# Altium project PCB_Soldering_Station.PrjPcb
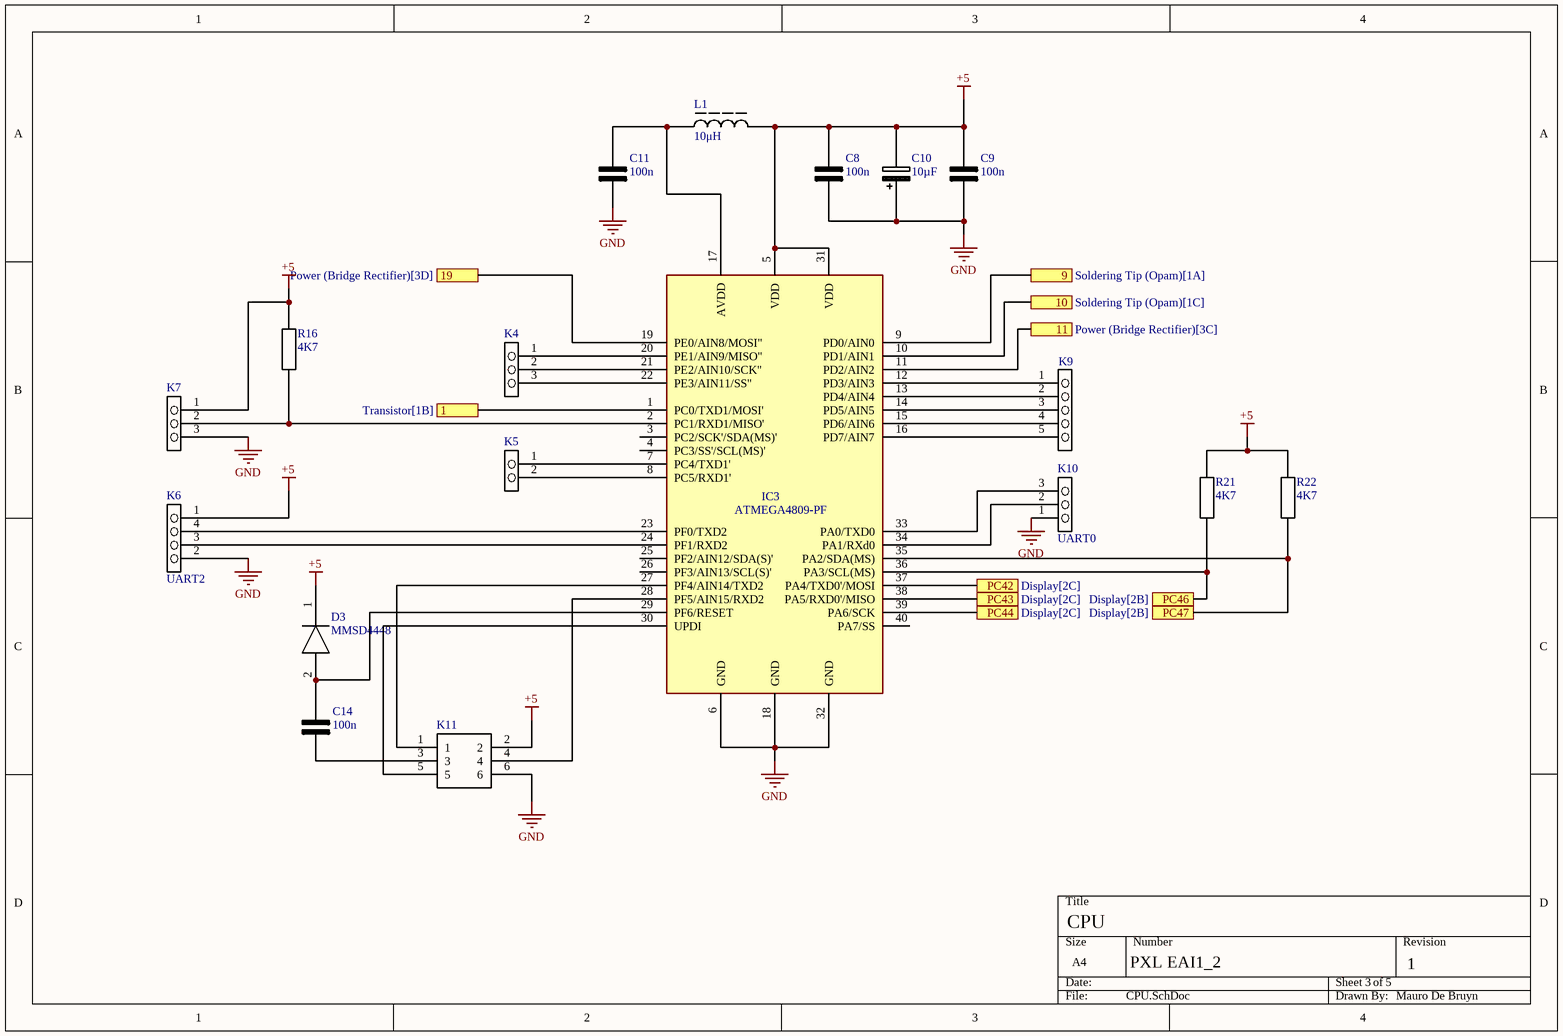
[diagram p0: CPU.SchDoc]
3 sheets, 53 parts. Net scope: flat (ports and power ports of the same name join across sheets).
Board files: PCB1.PcbDoc, PCB2.PcbDoc
Sheets:
  CPU.SchDoc
  Soldering Tip (Opam).SchDoc
  Power (Bridge Rectifier).SchDoc

## Sheet CPU.SchDoc: CPU
size A4; DrawnBy: Mauro De Bruyn; Revision: 1; SheetNumber: 3; SheetTotal: 5; Number: PXL EAI1_2

### Parts
C8  100n  [0805]
C9  100n  [0805]
C10  10µF  [CAPPRD200W52D500H1250]
C11  100n  [0805]
C14  100n  [0805]
D3  MMSD4448  [SOD3816X128N]
IC3  ATMEGA4809-PF  [DIP1543W58P254L5175H635Q40N]
K4  M20-9990345  [HDRV3W64P0X254_1X3_762X254X864P]  (value not drawn)
K5  M20-9990246  [HDRV2W66P0X254_1X2_508X254X874P]  (value not drawn)
K6  UART2  [HDRV4W64P0X254_1X4_1016X254X834P]
K7  M20-9990345  [HDRV3W64P0X254_1X3_762X254X864P]  (value not drawn)
K9  M20-9990545  [HDRV5W64P0X254_1X5_1270X254X864P]  (value not drawn)
K10  UART0  [HDRV3W64P0X254_1X3_762X254X864P]
K11  M20-9760342  [HDRV6W66P254_2X3_762X508X830P]  (value not drawn)
L1  10μH  [VLS56045]
R16  4K7  [0805]
R21  4K7  [0805]
R22  4K7  [0805]

### Ports
1 (see Transistor[1B]), 9 (see Soldering Tip (Opam)[1A]), 10 (see Soldering Tip (Opam)[1C]), 11 (see Power (Bridge Rectifier)[3C]), 19 (see Power (Bridge Rectifier)[3D]), PC42 (see Display[2C]), PC43 (see Display[2C]), PC44 (see Display[2C]), PC46 (see Display[2B]), PC47 (see Display[2B])

### Nets
+5: C8.2(-) C9.2(-) C10.2(-) D3.1(K) IC3.5(VDD) IC3.31(VDD) K6.1 K7.1 K11.2 L1.2 R16.2 R21.2 R22.2
GND: C8.1(+) C9.1(+) C10.1(+) C11.1(+) IC3.6(GND) IC3.18(GND) IC3.32(GND) K6.2 K7.3 K10.1 K11.6
NetC6_2: IC3.9(PD0/AIN0) ; port 9
NetC11_2: C11.2(-) IC3.17(AVDD) L1.1
NetC12_2: IC3.10(PD1/AIN1) ; port 10
NetC14_1: C14.1(+) K11.3
NetC14_2: C14.2(-) D3.2(A) IC3.29(PF6/RESET)
NetD2_1: IC3.11(PD2/AIN2) ; port 11
NetIC3_1: IC3.1(PC0/TXD1/MOSI') ; port 1
NetIC3_2: IC3.2(PC1/RXD1/MISO') K7.2 R16.1
NetIC3_7: IC3.7(PC4/TXD1') K5.1
NetIC3_8: IC3.8(PC5/RXD1') K5.2
NetIC3_12: IC3.12(PD3/AIN3) K9.1
NetIC3_13: IC3.13(PD4/AIN4) K9.2
NetIC3_14: IC3.14(PD5/AIN5) K9.3
NetIC3_15: IC3.15(PD6/AIN6) K9.4
NetIC3_16: IC3.16(PD7/AIN7) K9.5
NetIC3_19: IC3.19(PE0/AIN8/MOSI") ; port 19
NetIC3_20: IC3.20(PE1/AIN9/MISO") K4.1
NetIC3_21: IC3.21(PE2/AIN10/SCK") K4.2
NetIC3_22: IC3.22(PE3/AIN11/SS") K4.3
NetIC3_23: IC3.23(PF0/TXD2) K6.4
NetIC3_24: IC3.24(PF1/RXD2) K6.3
NetIC3_27: IC3.27(PF4/AIN14/TXD2) K11.1
NetIC3_28: IC3.28(PF5/AIN15/RXD2) K11.4
NetIC3_30: IC3.30(UPDI) K11.5
NetIC3_33: IC3.33(PA0/TXD0) K10.3
NetIC3_34: IC3.34(PA1/RXd0) K10.2
NetIC3_35: IC3.35(PA2/SDA(MS)) R22.1 ; port PC47
NetIC3_36: IC3.36(PA3/SCL(MS)) R21.1 ; port PC46
NetIC3_37: IC3.37(PA4/TXD0'/MOSI) ; port PC42
NetIC3_38: IC3.38(PA5/RXD0'/MISO) ; port PC43
NetIC3_39: IC3.39(PA6/SCK) ; port PC44

Not connected (* = marked no-connect by the designer): IC3 3(PC2/SCK'/SDA(MS)') 4(PC3/SS'/SCL(MS)') 25(PF2/AIN12/SDA(S)') 26(PF3/AIN13/SCL(S)') 40(PA7/SS)

### Library data of the parts
C8 C9 C11 C14 = 0805 (Capacitor): Capacitor; Manufacturer_Name: Kemet; Manufacturer_Part_Number: C0805C391G3GACTU; Datasheet Link: https://content.kemet.com/datasheets/KEM_C1003_C0G_SMD.pdf; Height: 1.1mm
C10 = 860020672010: Capacitor Polarised; Manufacturer_Name: Wurth Elektronik; Datasheet Link: https://componentsearchengine.com//860020672010.pdf; Height: 12.5mm; Mouser2 Part Number: 710-860020672010; Mouser2 Price/Stock: https://www.mouser.com/Search/Refine.aspx?Keyword=710-860020672010; Manufacturer_Part_Number: 860020672010
D3 = MMSD4448: Diode; Manufacturer_Name: onsemi; Datasheet Link: https://datasheet.datasheetarchive.com/originals/distributors/Datasheets_SAMA/ce1b7d7eb81c2fed950cf88eaf7986e9.pdf; Height: 1.28mm; Manufacturer_Part_Number: MMSD4448; Mouser Part Number: 512-MMSD4448; Mouser Price/Stock: https://www.mouser.co.uk/ProductDetail/onsemi-Fairchild/MMSD4448?qs=HxNY1oXTrTS1XYzDYVbdxA%3D%3D; Arrow Part Number: MMSD4448; Arrow Price/Stock: https://www.arrow.com/en/products/mmsd4448/on-semiconductor?region=nac
IC3 = ATMEGA4809-PF: Integrated Circuit; Manufacturer_Name: Microchip; Datasheet Link: https://componentsearchengine.com//ATMEGA4809-PF.pdf; Height: 6.35mm; Mouser2 Part Number: 556-ATMEGA4809-PF; Mouser2 Price/Stock: https://www.mouser.com/Search/Refine.aspx?Keyword=556-ATMEGA4809-PF; Manufacturer_Part_Number: ATMEGA4809-PF
K4 K7 K10 = M20-9990345: Connector 3-PIN; Manufacturer_Name: Harwin; Datasheet Link: https://componentsearchengine.com//M20-9990345.pdf; Height: 8.64mm; Mouser2 Part Number: 855-M20-9990345; Mouser2 Price/Stock: https://www.mouser.com/Search/Refine.aspx?Keyword=855-M20-9990345; Manufacturer_Part_Number: M20-9990345
K5 = M20-9990246: Connector 2-PIN; Manufacturer_Name: Harwin; Datasheet Link: https://componentsearchengine.com//M20-9990246.pdf; Height: 8.74mm; Mouser2 Part Number: 855-M20-9990246; Mouser2 Price/Stock: https://www.mouser.com/Search/Refine.aspx?Keyword=855-M20-9990246; Manufacturer_Part_Number: M20-9990246
K6 = M20-9770446: Connector 4-PIN; Manufacturer_Name: Harwin; Datasheet Link: https://componentsearchengine.com//M20-9770446.pdf; Height: 8.34mm; Mouser2 Part Number: 855-M20-9770446; Mouser2 Price/Stock: https://www.mouser.com/Search/Refine.aspx?Keyword=855-M20-9770446; Manufacturer_Part_Number: M20-9770446
K9 = M20-9990545: Connector 5-PIN; Manufacturer_Name: Harwin; Datasheet Link: https://componentsearchengine.com//M20-9990545.pdf; Height: 8.64mm; Mouser2 Part Number: 855-M20-9990545; Mouser2 Price/Stock: https://www.mouser.com/Search/Refine.aspx?Keyword=855-M20-9990545; Manufacturer_Part_Number: M20-9990545
K11 = M20-9760342: Connector 6-PIN; Manufacturer_Name: Harwin; Datasheet Link: https://cdn.harwin.com/pdfs/M20-976.pdf; Height: 8.3mm; Manufacturer_Part_Number: M20-9760342
L1 = VLS6045EX-100M-H: Inductor; Manufacturer_Name: TDK; Datasheet Link: https://componentsearchengine.com//VLS6045EX-100M-H.pdf; Mouser2 Part Number: 810-VLS6045EX-100M-H; Mouser2 Price/Stock: https://www.mouser.com/Search/Refine.aspx?Keyword=810-VLS6045EX-100M-H; Manufacturer_Part_Number: VLS6045EX-100M-H
R16 R21 R22 = 0805 (Resistor): Resistor; Manufacturer_Name: Kemet; Manufacturer_Part_Number: C0805C391G3GACTU; Datasheet Link: https://content.kemet.com/datasheets/KEM_C1003_C0G_SMD.pdf; Height: 1.1mm

## Sheet Soldering Tip (Opam).SchDoc: Opam
size A4; DrawnBy: Mauro De Bruyn; Revision: 1; SheetNumber: 4; SheetTotal: 5; Number: PXL EAI1_2
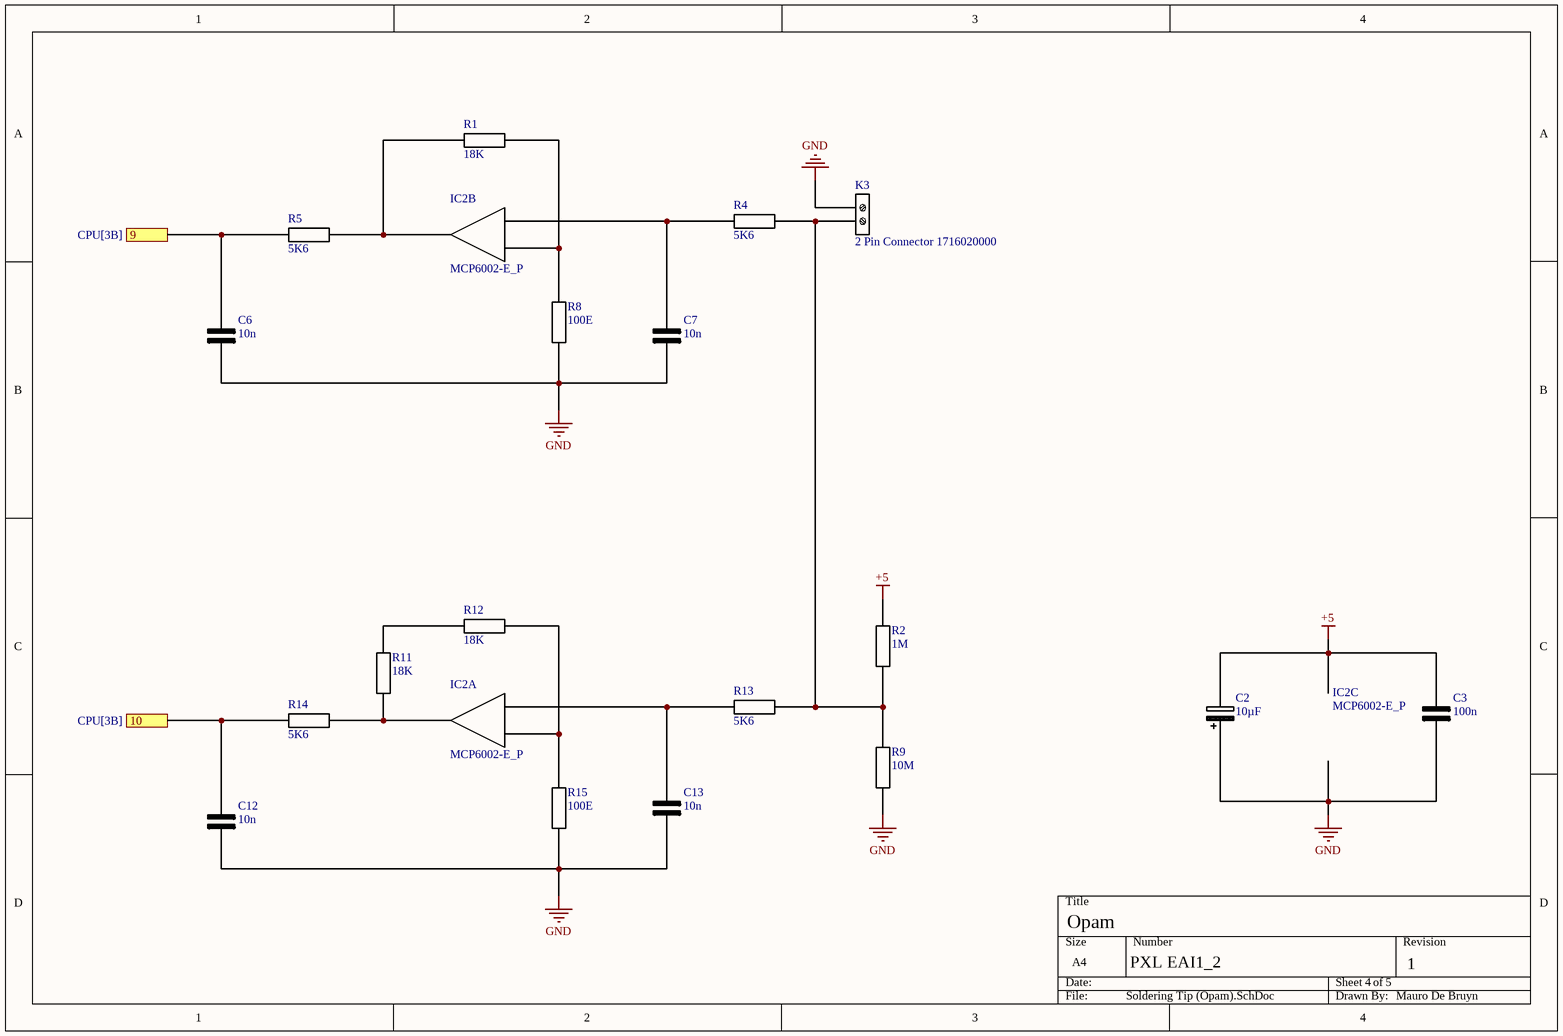
[diagram p1: Soldering Tip (Opam).SchDoc]

### Parts
C2  10µF  [CAPPRD200W52D500H1250]
C3  100n  [0805]
C6  10n  [0805]
C7  10n  [0805]
C12  10n  [0805]
C13  10n  [0805]
IC2  MCP6002-E_P  [DIP781W56P254L950H533Q8N]  (parts A,B,C of 3)
K3  2 Pin Connector 1716020000  [1716020000]
R1  18K  [0805]
R2  1M  [0805]
R4  5K6  [0805]
R5  5K6  [0805]
R8  100E  [0805]
R9  10M  [0805]
R11  18K  [0805]
R12  18K  [0805]
R13  5K6  [0805]
R14  5K6  [0805]
R15  100E  [0805]

### Ports
9 (see CPU[3B]), 10 (see CPU[3B])

### Nets
+5: C2.2(-) C3.2(-) IC2.8(VDD) R2.2
GND: C2.1(+) C3.1(+) C6.1(+) C7.1(+) C12.1(+) C13.1(+) IC2.4(VSS) K3.1 R8.1 R9.1 R15.1
NetC6_2: C6.2(-) R5.1 ; port 9
NetC7_2: C7.2(-) IC2.5(VINB+) R4.1
NetC12_2: C12.2(-) R14.1 ; port 10
NetC13_2: C13.2(-) IC2.3(VINA+) R13.1
NetIC2_1: IC2.1(VOUTA) R11.1 R14.2
NetIC2_2: IC2.2(VINA-) R12.1 R15.2
NetIC2_6: IC2.6(VINB-) R1.2 R8.2
NetIC2_7: IC2.7(VOUTB) R1.1 R5.2
NetK3_2: K3.2 R2.1 R4.2 R9.2 R13.2
NetR11_2: R11.2 R12.2

### Library data of the parts
C2 = 860020672010: as C10 on sheet CPU; Datasheet Link: https://componentsearchengine.com//860020672010.pdf; Height: 12.5mm; Mouser2 Part Number: 710-860020672010; Mouser2 Price/Stock: https://www.mouser.com/Search/Refine.aspx?Keyword=710-860020672010; Manufacturer_Part_Number: 860020672010
C3 C6 C7 C12 C13 = 0805 (Capacitor): as C8 on sheet CPU; Datasheet Link: https://content.kemet.com/datasheets/KEM_C1003_C0G_SMD.pdf; Height: 1.1mm
IC2 = MCP6002-E_P: Integrated Circuit; Manufacturer_Name: Microchip; Manufacturer_Part_Number: MCP6002-E/P; Datasheet Link: https://componentsearchengine.com//MCP6002-E_P.pdf; Height: 5.334mm; Mouser2 Part Number: 579-MCP6002-E/P; Mouser2 Price/Stock: https://www.mouser.com/Search/Refine.aspx?Keyword=579-MCP6002-E%2FP
K3 = 2 Pin Connector 1716020000: Connector; Manufacturer_Name: Weidmuller; Datasheet Link: https://catalog.weidmueller.com/catalog/Start.do?ObjectID=1716020000&_ga=2.21797499.1716783809.1613378202-511725545.1613378202; Manufacturer_Part_Number: 1716020000
R1 R2 R4 R5 R8 R9 R11-R15 = 0805 (Resistor): as R16 on sheet CPU; Datasheet Link: https://content.kemet.com/datasheets/KEM_C1003_C0G_SMD.pdf; Height: 1.1mm

## Sheet Power (Bridge Rectifier).SchDoc: Bridge Rectifier
size A4; DrawnBy: Mauro De Bruyn; Revision: 1; SheetNumber: 5; SheetTotal: 5; Number: PXL EAI1_2
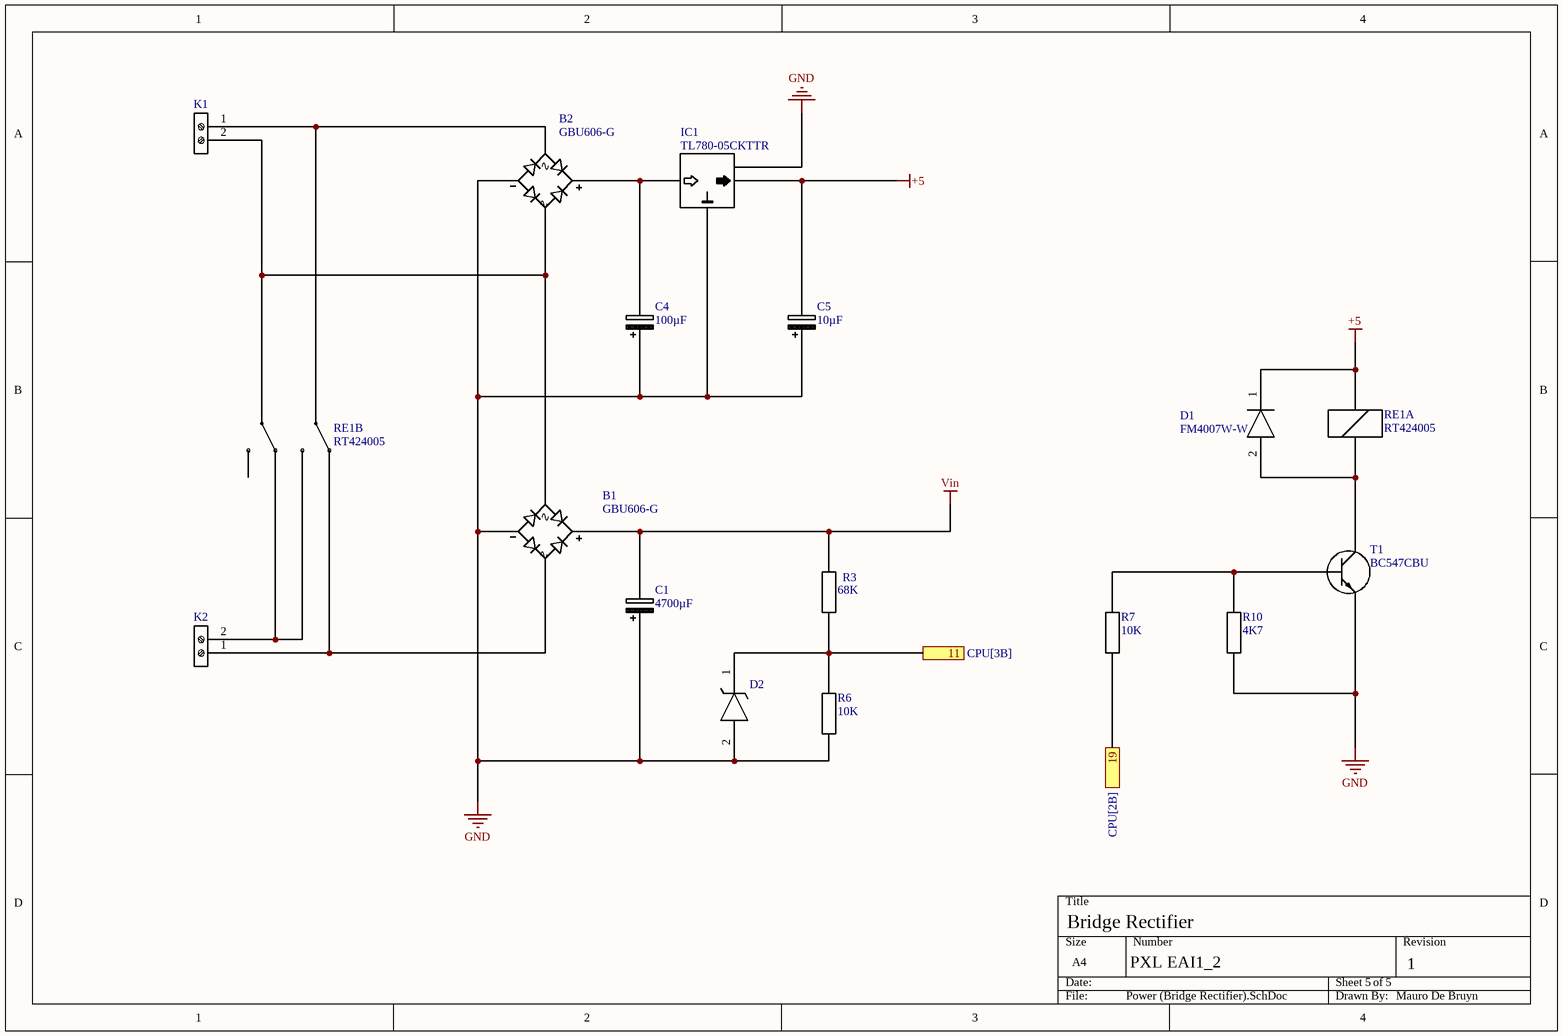
[diagram p2: Power (Bridge Rectifier).SchDoc]

### Parts
B1  GBU606-G  [GBU606G]
B2  GBU606-G  [GBU606G]
C1  4700µF  [CAPPRD750W80D1850H4150]
C4  100µF  [CAPPRD350W60D825H1300]
C5  10µF  [CAPPRD200W52D500H1250]
D1  FM4007W-W  [DIOM5025X231N]
D2  SZMMSZ5231BT1G  [SOD3716X135N]  (value not drawn)
IC1  TL780-05CKTTR  [TL78005CKTTR]
K1  2 Pin Connector 1716020000  [1716020000]  (value not drawn)
K2  2 Pin Connector 1716020000  [1716020000]  (value not drawn)
R3  68K  [0805]
R6  10K  [0805]
R7  10K  [0805]
R10  4K7  [0805]
RE1  RT424005  [RT42]  (parts A,B of 2)
T1  BC547CBU  [BC547CBU]

### Ports
11 (see CPU[3B]), 19 (see CPU[2B])

### Nets
+5: C5.2(-) D1.1(K) IC1.3(OUTPUT) RE1.1(A1_COIL)
GND: B1.4(-) B2.4(-) C1.1(+) C4.1(+) C5.1(+) D2.2(A) IC1.2(COMMON_1) IC1.4(COMMON_2) R6.1 R10.2 T1.3(E)
Vin: B1.1(+) C1.2(-) R3.2
NetB1_2: B1.2(~_1) K2.1 RE1.7(22_NC)
NetB1_3: B1.3(~_2) B2.2(~_1) K1.2 RE1.3(11_COM)
NetB2_1: B2.1(+) C4.2(-) IC1.1(INPUT)
NetB2_3: B2.3(~_2) K1.1 RE1.6(21_COM)
NetD1_2: D1.2(A) RE1.8(A2_COIL) T1.1(C)
NetD2_1: D2.1(K) R3.1 R6.2 ; port 11
NetIC3_19: R7.2 ; port 19
NetK2_2: K2.2 RE1.2(12_NC) RE1.5(24_NO)
NetR7_1: R7.1 R10.1 T1.2(B)

Not connected (* = marked no-connect by the designer): RE1 4(14_NO)

### Notes on the sheet
- (in symbol GBU606-G) ∿

### Library data of the parts
B1 B2 = GBU606-G: Bridge Rectifier; Manufacturer_Name: Comchip Technology; Datasheet Link: https://www.comchiptech.com/product.php?id=2217; Height: 20.95mm; Manufacturer_Part_Number: GBU606-G
C1 = 50PK4700MEFC18X40: Capacitor Polarised; Manufacturer_Name: Rubycon; Datasheet Link: https://componentsearchengine.com//50PK4700MEFC18X40.pdf; Height: 41.5mm; Mouser2 Part Number: 232-50PK4700MEFC18X4; Mouser2 Price/Stock: https://www.mouser.com/Search/Refine.aspx?Keyword=232-50PK4700MEFC18X4; Manufacturer_Part_Number: 50PK4700MEFC18X40
C4 = RGA101M1HBK-0811G: Capacitor Polarised; Manufacturer_Name: Lelon; Datasheet Link: https://www.arrow.com/en/products/rga101m1hbk-0811g/lelon-electronics; Height: 13mm; Manufacturer_Part_Number: RGA101M1HBK-0811G
C5 = 860020672010: as C10 on sheet CPU; Datasheet Link: https://componentsearchengine.com//860020672010.pdf; Height: 12.5mm; Mouser2 Part Number: 710-860020672010; Mouser2 Price/Stock: https://www.mouser.com/Search/Refine.aspx?Keyword=710-860020672010; Manufacturer_Part_Number: 860020672010
D1 = FM4007W-W: Bridge Rectifier; Manufacturer_Name: Rectron; Datasheet Link: https://componentsearchengine.com//FM4007W-W.pdf; Height: 2.31mm; Mouser2 Part Number: 583-FM4007W-W; Mouser2 Price/Stock: https://www.mouser.com/Search/Refine.aspx?Keyword=583-FM4007W-W; Manufacturer_Part_Number: FM4007W-W
D2 = SZMMSZ5231BT1G: Zener Diode; Manufacturer_Name: onsemi; Datasheet Link: https://www.onsemi.com/pdf/datasheet/mmsz5221bt1-d.pdf; Height: 1.35mm; Manufacturer_Part_Number: SZMMSZ5231BT1G; Mouser Part Number: 863-SZMMSZ5231BT1G; Mouser Price/Stock: https://www.mouser.co.uk/ProductDetail/onsemi/SZMMSZ5231BT1G?qs=tYFd4l%252BlHeQgPMc6zsX19w%3D%3D; Arrow Part Number: SZMMSZ5231BT1G; Arrow Price/Stock: https://www.arrow.com/en/products/szmmsz5231bt1g/on-semiconductor?region=nac
IC1 = TL780-05CKTTR: Integrated Circuit; Manufacturer_Name: Texas Instruments; Datasheet Link: http://www.ti.com/general/docs/suppproductinfo.tsp?distId=26&gotoUrl=http%3A%2F%2Fwww.ti.com%2Flit%2Fgpn%2Ftl780; Height: 5.08mm; Manufacturer_Part_Number: TL780-05CKTTR
K1 K2 = 2 Pin Connector 1716020000: Connector; Manufacturer_Name: Weidmuller; Datasheet Link: https://catalog.weidmueller.com/catalog/Start.do?ObjectID=1716020000&_ga=2.21797499.1716783809.1613378202-511725545.1613378202; Manufacturer_Part_Number: 1716020000
R3 R6 R7 R10 = 0805 (Resistor): as R16 on sheet CPU; Datasheet Link: https://content.kemet.com/datasheets/KEM_C1003_C0G_SMD.pdf; Height: 1.1mm
RE1 = RT424005: Relay or Contactor; Manufacturer_Name: TE Connectivity; Datasheet Link: https://componentsearchengine.com//RT424005.pdf; Mouser2 Part Number: 655-RT424005; Mouser2 Price/Stock: https://www.mouser.com/Search/Refine.aspx?Keyword=655-RT424005; Manufacturer_Part_Number: RT424005
T1 = BC547CBU: Transistor BJT NPN; Manufacturer_Name: ON Semiconductor; Datasheet Link: https://www.onsemi.com/pdf/datasheet/bc550-d.pdf; Height: 5.33mm; Manufacturer_Part_Number: BC547CBU

## Nets that join several sheets
+5: CPU (13 pins), Soldering Tip (Opam) (C2.2 C3.2 IC2.8 R2.2), Power (Bridge Rectifier) (C5.2 D1.1 IC1.3 RE1.1)
GND: CPU (11 pins), Soldering Tip (Opam) (11 pins), Power (Bridge Rectifier) (11 pins)
NetC6_2: CPU (IC3.9), Soldering Tip (Opam) (C6.2 R5.1)
NetC12_2: CPU (IC3.10), Soldering Tip (Opam) (C12.2 R14.1)
NetD2_1: CPU (IC3.11), Power (Bridge Rectifier) (D2.1 R3.1 R6.2)
NetIC3_19: CPU (IC3.19), Power (Bridge Rectifier) (R7.2)